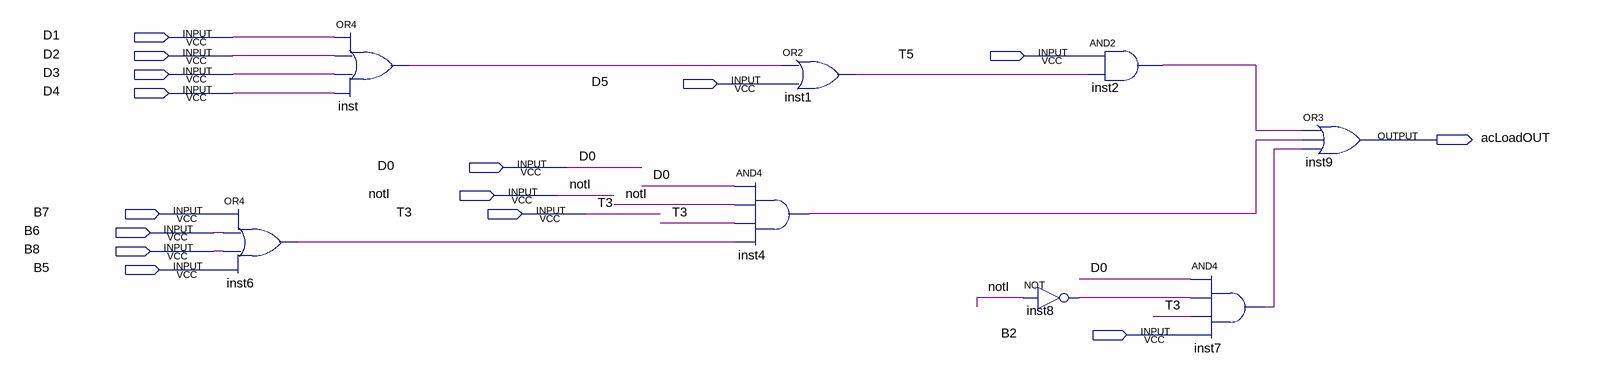
[diagram p0: schematic sheet]
// Quartus schematic acLoad.bdf as structural Verilog: 8 symbols, 15 pins
module acLoad (
  input  D1,
  input  D2,
  input  T5,
  input  D3,
  input  D5,
  input  D4,
  input  D0,
  input  notI,
  input  B7,
  input  T3,
  input  B6,
  input  B8,
  input  B5,
  input  B2,
  output acLoadOUT
);

  wire inst1_out, inst2_out, inst4_out, inst6_out, inst7_out, inst8_out, inst_out;

  or inst6 (inst6_out, B7, B6, B8, B5);
  or inst (inst_out, D1, D2, D3, D4);
  and inst4 (inst4_out, D0, notI, T3, inst6_out);
  or inst1 (inst1_out, inst_out, D5);
  not inst8 (inst8_out, notI);
  and inst2 (inst2_out, T5, inst1_out);
  and inst7 (inst7_out, D0, inst8_out, T3, B2);
  or inst9 (acLoadOUT, inst2_out, inst4_out, inst7_out);
endmodule
